# EAGLE design roduinoRF2 (EAGLE 6.2)
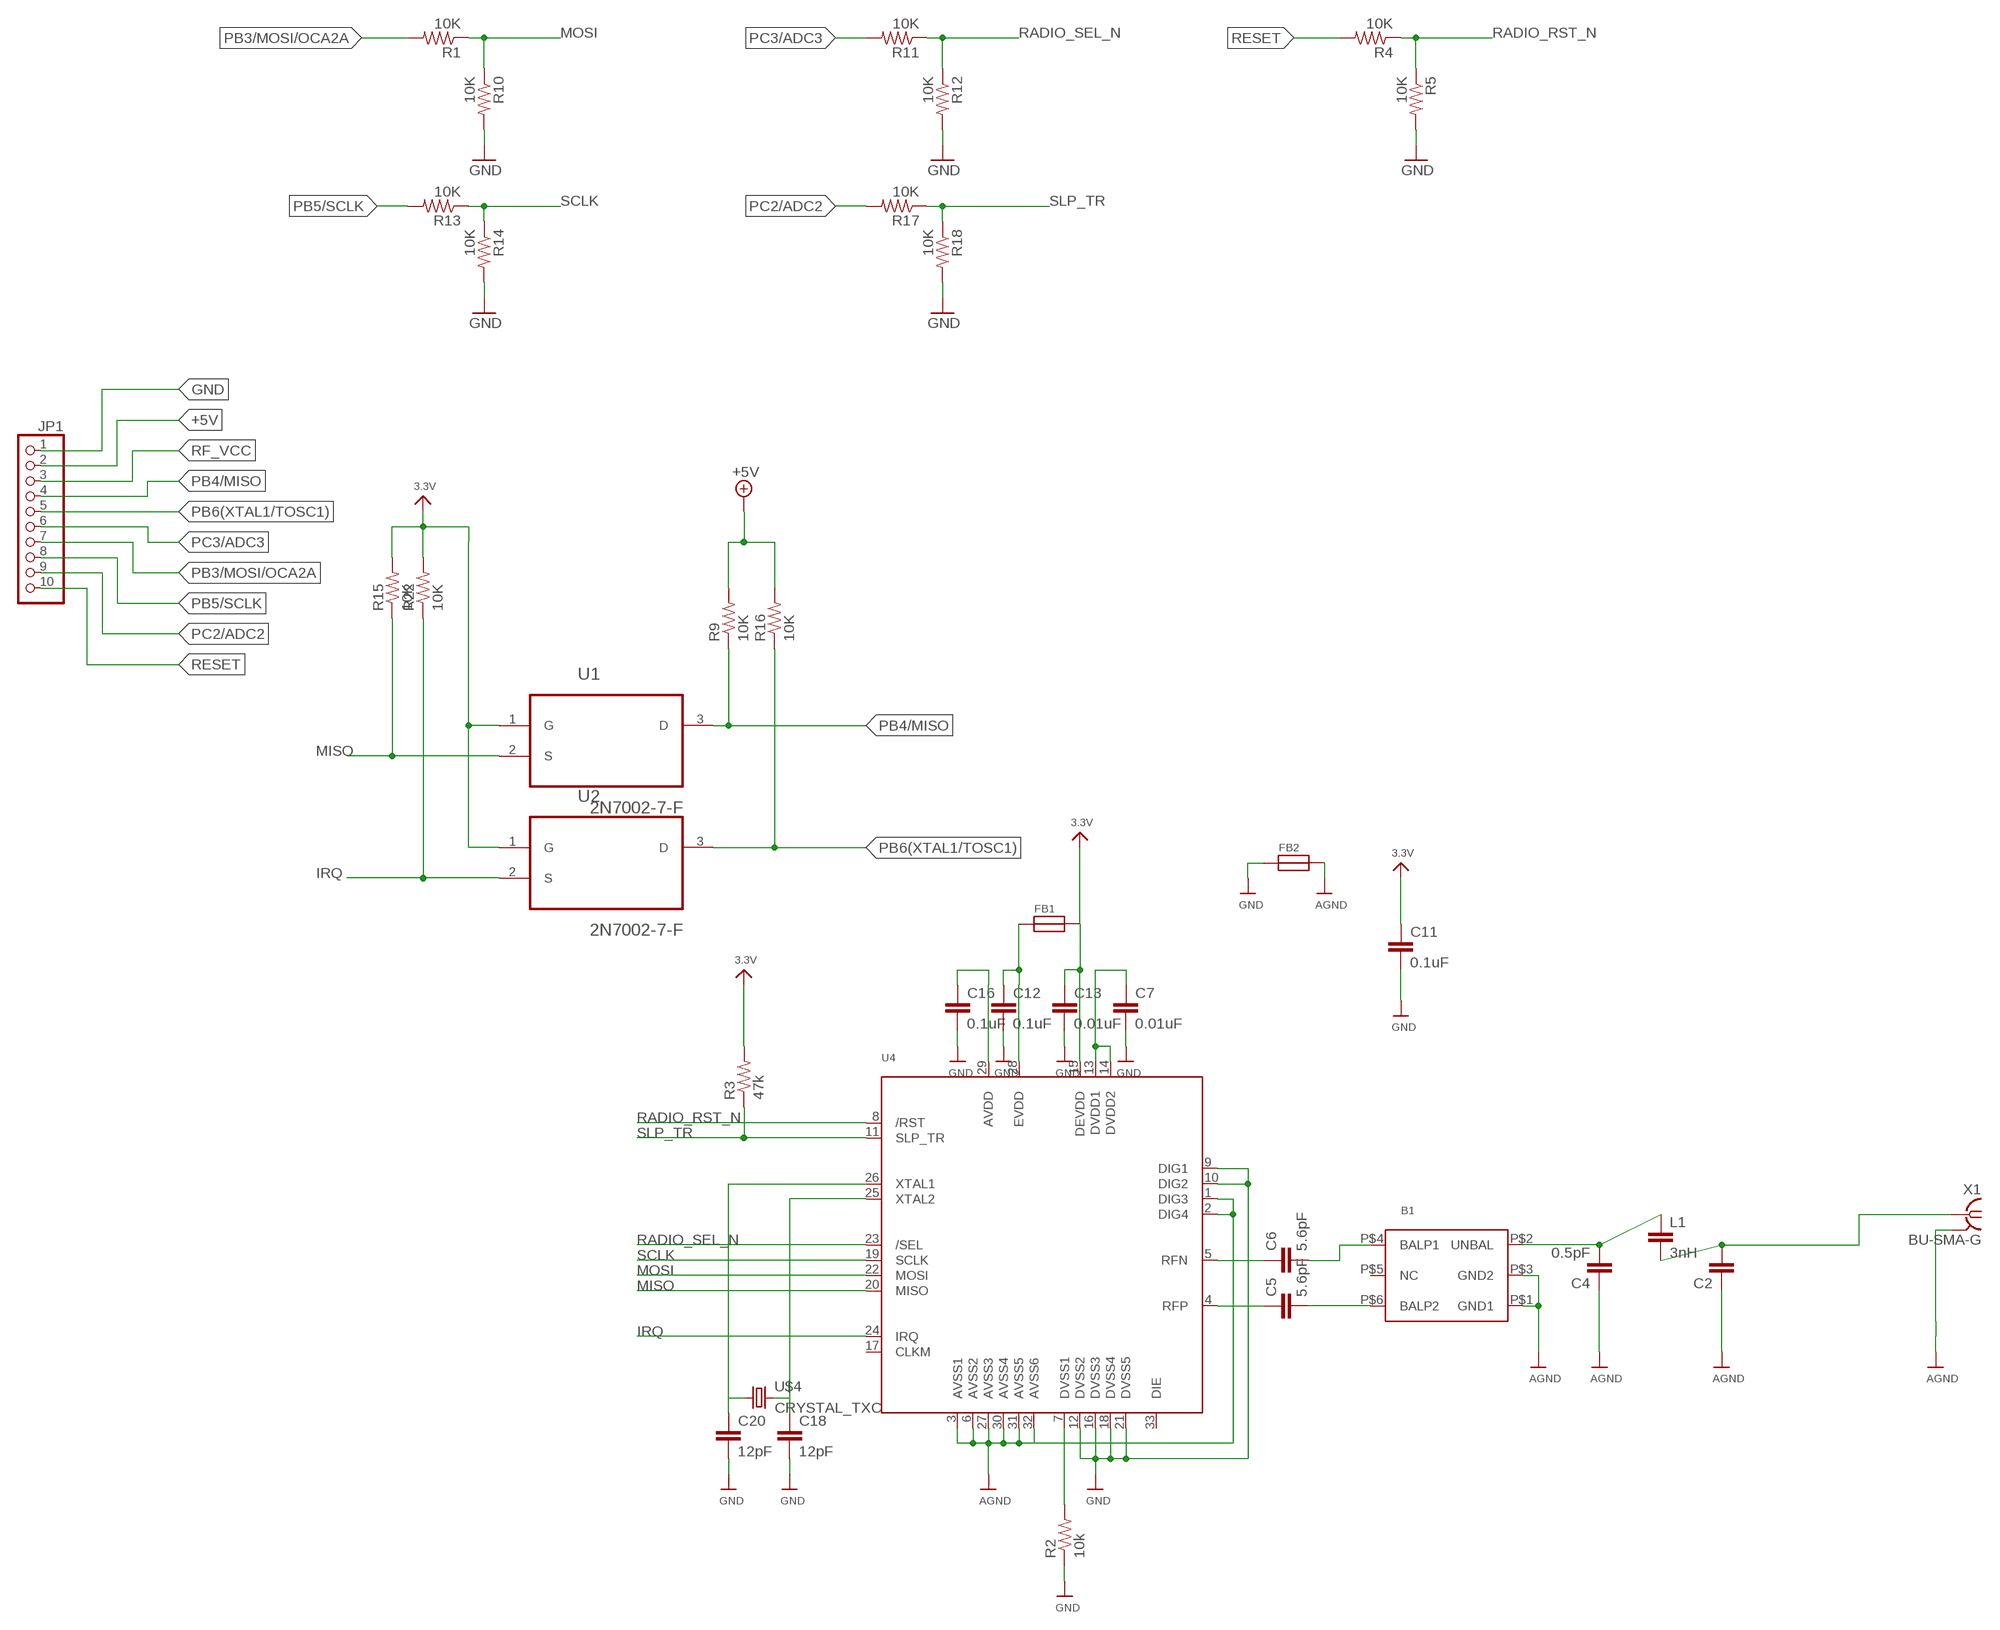
[diagram p0: schematic, sheet 1]

## Parts
B1  BALUN  [BALUN1206]
C2  CAP0805  [0805]
C4  0.5pF  CAP0805  [0805]
C5  5.6pF  CAP0805  [0805]
C6  5.6pF  CAP0805  [0805]
C7  0.01uF  CAP0805  [0805]
C11  0.1uF  CAP0805  [0805]
C12  0.1uF  CAP0805  [0805]
C13  0.01uF  CAP0805  [0805]
C16  0.1uF  CAP0805  [0805]
C18  12pF  CAP0805  [0805]
C20  12pF  CAP0805  [0805]
FB1  FERRITE  [0603]
FB2  FERRITE  [0603]
JP1  PINHD-1X10  [1X10]
L1  3nH  CAP0805  [0805]
R1  10K  RESISTOR0805-RES  [0805]
R2  10k  RESISTOR0805-RES  [0805]
R3  47k  RESISTOR0805-RES  [0805]
R4  10K  RESISTOR0805-RES  [0805]
R5  10K  RESISTOR0805-RES  [0805]
R9  10K  RESISTOR0805-RES  [0805]
R10  10K  RESISTOR0805-RES  [0805]
R11  10K  RESISTOR0805-RES  [0805]
R12  10K  RESISTOR0805-RES  [0805]
R13  10K  RESISTOR0805-RES  [0805]
R14  10K  RESISTOR0805-RES  [0805]
R15  10K  RESISTOR0805-RES  [0805]
R16  10K  RESISTOR0805-RES  [0805]
R17  10K  RESISTOR0805-RES  [0805]
R18  10K  RESISTOR0805-RES  [0805]
R22  10K  RESISTOR0805-RES  [0805]
U1  2N7002-7-F  [SOT103P240X110-3N]
U2  2N7002-7-F  [SOT103P240X110-3N]
U4  AT86RF212  [32QN2]
U$4  CRYSTAL_TXC  [CRYSTAL_TCX]
X1  BU-SMA-G  [BU-SMA-G]

## Nets
+5V: JP1.2 R9.2 R16.2
AGND: B1.P$1(GND1) B1.P$3(GND2) C2.1 C4.1 FB2.2 U4.1(DIG3) U4.2(DIG4) U4.3(AVSS1) U4.6(AVSS2) U4.27(AVSS3) U4.30(AVSS4) U4.31(AVSS5) U4.32(AVSS6) X1.5(GND)
GND: C7.2 C11.2 C12.2 C13.2 C16.2 C18.2 C20.2 FB2.1 JP1.1 R2.1 R5.2 R10.2 R12.2 R14.2 R18.2 U4.9(DIG1) U4.10(DIG2) U4.12(DVSS2) U4.16(DVSS3) U4.18(DVSS4) U4.21(DVSS5)
IRQ: R22.1 U2.2(S) U4.24(IRQ)
MISO: R15.1 U1.2(S) U4.20(MISO)
MOSI: R1.1 R10.1 U4.22(MOSI)
N$17: C6.1 U4.5(RFN)
N$20: C5.1 U4.4(RFP)
N$21: B1.P$4(BALP1) C6.2
N$22: B1.P$6(BALP2) C5.2
N$23: B1.P$2(UNBAL) C4.2 L1.1
N$24: C2.2 L1.2 X1.1
N$26: C20.1 U4.26(XTAL1) U$4.1
N$27: C18.1 U4.25(XTAL2) U$4.2
N$28: R2.2 U4.7(DVSS1)
N$29: C7.1 U4.13(DVDD1) U4.14(DVDD2)
N$30: C12.1 FB1.1 U4.28(EVDD)
N$31: C16.1 U4.29(AVDD)
PB3/MOSI/OCA2A: JP1.7 R1.2
PB4/MISO: JP1.4 R9.1 U1.3(D)
PB5/SCLK: JP1.8 R13.2
PB6(XTAL1/TOSC1): JP1.5 R16.1 U2.3(D)
PC2/ADC2: JP1.9 R17.2
PC3/ADC3: JP1.6 R11.2
RADIO_RST_N: R4.1 R5.1 U4.8(/RST)
RADIO_SEL_N: R11.1 R12.1 U4.23(/SEL)
RESET: JP1.10 R4.2
RF_VCC: C11.1 C13.1 FB1.2 JP1.3 R3.2 R15.2 R22.2 U1.1(G) U2.1(G) U4.15(DEVDD) ; supply symbol labelled 3.3V
SCLK: R13.1 R14.1 U4.19(SCLK)
SLP_TR: R3.1 R17.1 R18.1 U4.11(SLP_TR)
Unconnected: B1.P$5(NC) U4.17(CLKM) U4.33(DIE)

## Power pins joined to a net without a drawn wire
AGND: X1.2(AGND) X1.3(AGND) X1.4(AGND)

## Library data of the parts
B1 = microbuilder:BALUN: BALUN - Baluns for RF 1206 800-1000MHz Balun (1206) - Digikey: 712-1023-1-ND
C2 C4-C7 C11-C13 C16 C18 C20 L1 = SparkFun:CAP: Capacitor Standard 0603 ceramic capacitor, and 0.1" leaded capacitor.
FB1 FB2 = microbuilder:FERRITE: Ferrite Bead 0603 MMZ1608B121C - 120 Ohm, 600mA Ferrite Chip - Digikey: 445-2164-1-ND BK1608HW121-T - 120 Ohm, 600mA Ferrite Chip - Digikey: 587-1876-2-ND
JP1 = pinhead:PINHD-1X10: PIN HEADER
R1-R5 R9-R18 R22 = SparkFun:RESISTOR: Resistor Basic schematic elements and footprints for 0603, 1206, and PTH resistors.
U1 U2 = 2N7002:2N7002-7-F: N-CHANNEL ENHANCEMENT MODE FIELD EFFECT TRANSISTOR; MPN: 2N7002-7-F; OC_FARNELL: 1713823; OC_NEWARK: 25R5679; PACKAGE: SOT-23-3; SUPPLIER: DIODES INC.
U4 = microbuilder:AT86RF212: AT86RF212 - Low-Power SPI-based 700/800/900 MHz Transceiver Digikey: AT86RF212-ZU-ND
U$4 = crystal_txc:CRYSTAL_TXC: TXC - 7A-16.000MAAJ-T - XTAL, 16.000MHZ, 18PF, SMD, 5.0X3.2
X1 = con-coax:BU-SMA-G: FEMALE SMA CONNECTOR Radiall distributor RS 193-9117; OC_FARNELL: unknown; OC_NEWARK: unknown

## Net classes
1 power: width 0.61 mm, drill 0.61 mm, clearance 0.254 mm
2 gnd: width 0.305 mm, drill 0.559 mm, clearance 0.254 mm
3 usbvcc: width 0.508 mm, drill 0.61 mm, clearance 0.254 mm

## Board
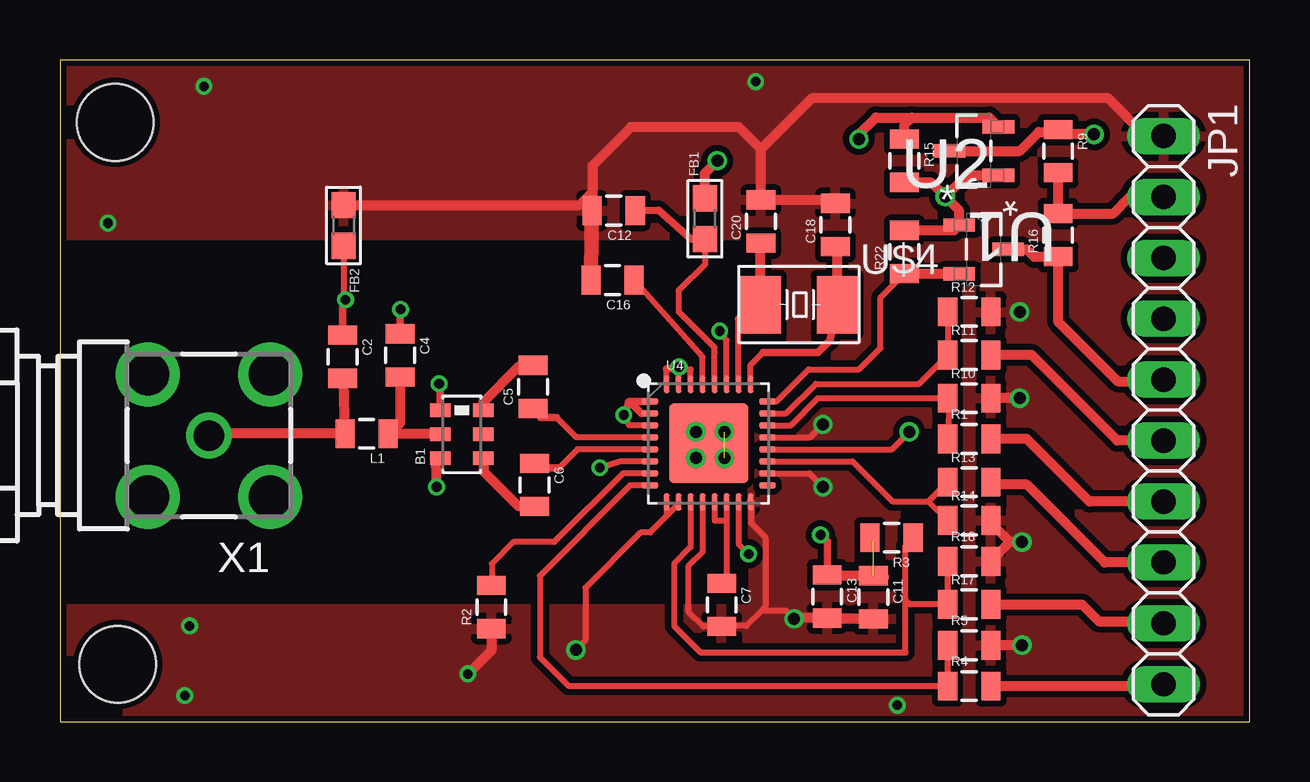
[diagram p1: board, top side]
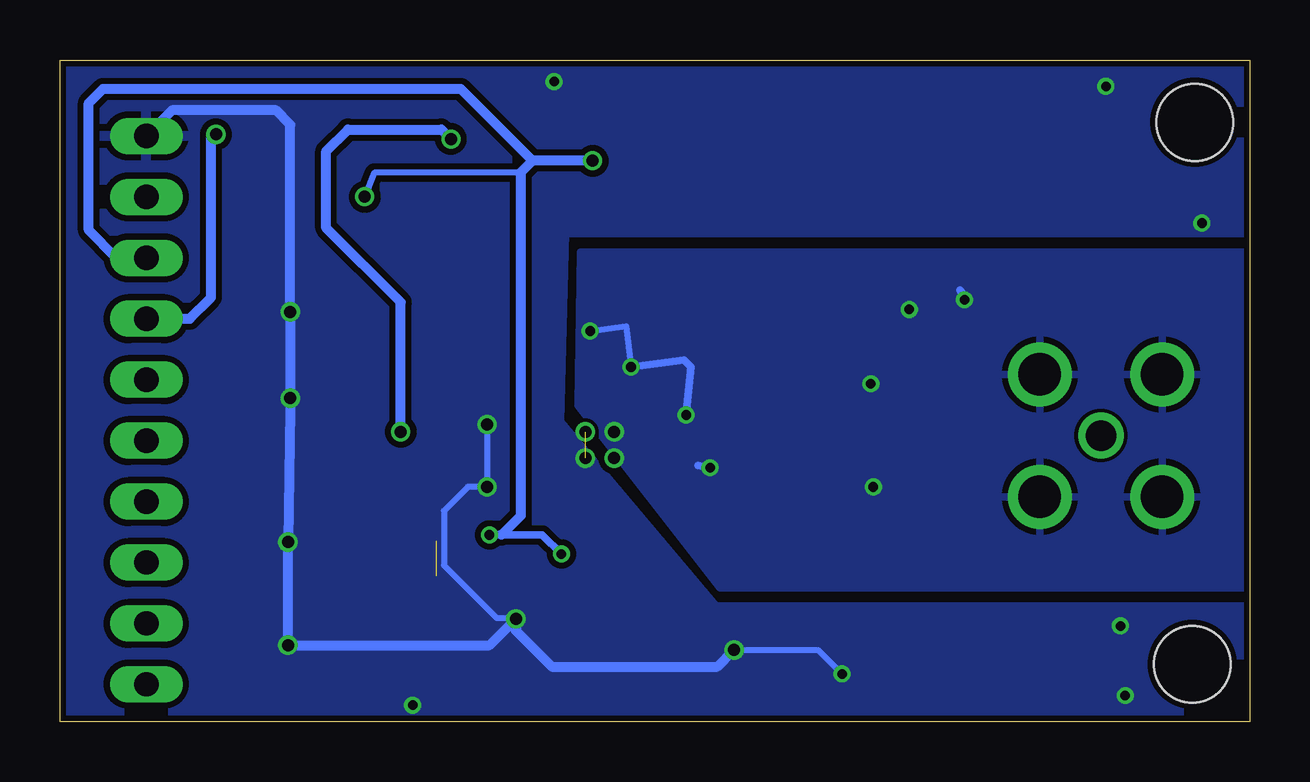
[diagram p2: board, bottom side, seen from below]

Size 49.6 x 27.6 mm. Coordinates in mm from the lower left corner, seen from the top.
Outline: 0,0 49.6,0 49.6,27.6 0,27.6 0,0
Copper layers (1*16): Top 0.035mm / dielectric 1.5mm / Bottom 0.035mm
Design rules: minimum track width 6mil, minimum drill 12mil, track to track 6mil, track to pad 6mil, pad to pad 6mil, via to via 6mil, smd to smd 0mil, copper to edge 10mil, drill to drill 10mil, minimum pad ring 10mil, minimum via ring 6mil, stop-mask expansion 2mil, vias tented up to drill 100mil, thermal gap 10mil
Holes 3.2 mm at 2.3,25 2.4,2.4

### Footprints (pad centres in the part's own frame; a part is rotated, then mirrored left to right if it is on the bottom)
BALUN1206 = smd 0.55 x 0.85: P$1 1,0.9; P$2 0,0.9; P$3 -1,0.9; P$4 -1,-0.9; P$5 0,-0.9; P$6 1,-0.9
0805 = smd 0.8 x 1.2: 1 -0.9,0; 2 0.9,0
0603 = smd 1.1 x 1: 1 -0.85,0; 2 0.85,0
1X10 = drill 1.016 long: 1 -11.43,0; 2 -8.89,0; 3 -6.35,0; 4 -3.81,0; 5 -1.27,0; 6 1.27,0; 7 3.81,0; 8 6.35,0; 9 8.89,0; 10 11.43,0
SOT103P240X110-3N = smd 1.321 x 0.559: 1 -1.016,1.016; 2 -1.016,-1.016; 3 1.016,0
32QN2 = smd 0.7 x 0.25: 1 -2.45,1.75; 2 -2.45,1.25; 3 -2.45,0.75; 4 -2.45,0.25; 5 -2.45,-0.25; 6 -2.45,-0.75; 7 -2.45,-1.25; 8 -2.45,-1.75; 17 2.45,-1.75; 18 2.45,-1.25; 19 2.45,-0.75; 20 2.45,-0.25; 21 2.45,0.25; 22 2.45,0.75; 23 2.45,1.25; 24 2.45,1.75 | smd 0.25 x 0.7: 9 -1.75,-2.45; 10 -1.25,-2.45; 11 -0.75,-2.45; 12 -0.25,-2.45; 13 0.25,-2.45; 14 0.75,-2.45; 15 1.25,-2.45; 16 1.75,-2.45; 25 1.75,2.45; 26 1.25,2.45; 27 0.75,2.45; 28 0.25,2.45; 29 -0.25,2.45; 30 -0.75,2.45; 31 -1.25,2.45; 32 -1.75,2.45 | smd 3.3 x 3.3: 33 0,0
CRYSTAL_TCX = smd 1.7 x 2.4: 1 -1.6,0; 2 1.6,0
BU-SMA-G = drill 1.27: 1 0,0 | drill 1.778: 2 -2.55,2.55; 3 2.55,2.55; 4 2.55,-2.55; 5 -2.55,-2.55

### Placement (x,y rotation side)
B1  16.75,12 90 top
C2  11.78,15.23 270 top
C4  14.18,15.28 270 top
C5  19.72,13.97 90 top
C6  19.78,9.88 270 top
C7  27.58,4.88 270 top
C11  33.9,5.2 270 top
C12  23.08,21.32 180 top
C13  31.98,5.23 270 top
C16  23.03,18.42 180 top
C18  32.32,20.72 90 top
C20  29.22,20.87 90 top
FB1  26.88,20.98 90 top
FB2  11.82,20.7 270 top
JP1  46,13 270 top
L1  12.78,12.02 180 top
R1  37.9,11.8 0 top
R2  17.98,4.79 90 top
R3  34.66,7.68 180 top
R4  37.9,1.5 0 top
R5  37.9,3.2 0 top
R9  41.6,23.8 270 top
R10  37.9,13.5 0 top
R11  37.9,15.3 0 top
R12  37.9,17.1 0 top
R13  37.9,10 0 top
R14  37.9,8.4 0 top
R15  35.2,23.4 270 top
R16  41.6,20.3 90 top
R17  37.9,4.9 0 top
R18  37.9,6.7 0 top
R22  35.2,19.6 90 top
U1  38.1,23.8 180 top
U2  38.5,19.7 0 top
U4  27.04,11.62 0 top
U$4  30.8,17.4 0 top
X1  6.21,11.94 180 top

### Tracks (layer width: path | path; a pad name or v marks a point on that pad's centre or on a via)
+5V
  Top 0.406: R9.2 R16.2 43.9,21.2 44.6,21.9 JP1.2
AGND  (via drill 0.4, 0.5)
  Top 0.254: U4.32 25.29,14.71 25.3,14.7 25.8,14.7 | U4.2 24.23,12.87 | U4.3 23.73,12.37 23.7,12.4 v23.5,12.8 23.7,13.34 | U4.6 23.37,10.87 v22.5,10.6 | U4.27 27.79,15.91 v27.5,16.3 | U4.30 26.29,14.69 26.3,14.7 25.8,14.7 | U4.31 25.79,14.69 25.8,14.7 | FB2.2 11.82,17.68 v11.9,17.6
  Top 0.305: 25.29,14.71 v25.8,14.8 | U4.1 23.73,13.37 | 23.73,13.37 v23.5,12.8 | B1.P$1 15.85,14.25 v15.8,14.1 | C4.1 14.18,16.98 v14.2,17.2 | C2.1 11.78,17.28 v11.9,17.6 | 24.23,12.87 23.73,13.37 | 23.7,13.34 23.73,13.37
  Top 0.406: B1.P$3 15.65,10.85 v15.7,9.8
  Bottom 0.254: v27.5,16.3 26,16.5 v25.8,14.8
  Bottom 0.305: v25.8,14.8 23.6,15.1 23.3,14.8 v23.5,12.8 | v11.9,17.6 12.1,18 11.9,17.8 | v22.5,10.6 23,10.7
  other vias: 26.5,12.1 26.5,11
  pour Bottom: 0,5.6 22.1,5.6 28,13.2 27.9,19.6 0,19.6
GND  (via drill 0.4, 0.5)  (1 unrouted)
  Top 0.254: U4.12 26.8,7.1 26.2,6.5 26.2,4.6 26.82,3.98 C7.2 27.6,4 28.6,4 29.25,4.65 | U4.9 25.29,8.59 | 25.29,8.59 24.6,7.9 24.2,7.9 21.9,5.6 21.9,3.4 v21.5,3 | U4.10 25.79,9.09 25.29,8.59 | U4.16 28.8,8.3 29.4,7.7 29.4,4.8 29.25,4.65 | 29.25,4.65 30.25,4.65 v30.6,4.3 | U4.18 31.23,10.37 v31.8,9.8 | U4.21 31.27,11.87 v31.8,12.4
  Top 0.305: U4.16
  Top 0.406: R2.1 17.98,2.98 v17,2 | C11.2 32.01,4.3 C13.2 30.63,4.33 v30.6,4.3 | 38.9,13.4 R10.2 v40,13.5 | v40.1,7.5 39.6,7.5 | 39.6,7.5 R18.2 | R14.2 38.8,8.3 39.6,7.5 | v40.1,3.2 R5.2 | C18.2 32.17,21.77 C20.2 29.22,23.88 | 29.22,23.88 28.3,24.8 23.8,24.8 22.2,23.2 22.2,22.1 | 22.2,22.1 22.2,21.34 C12.2 | JP1.1 45.27,24.43 43.7,26 31.34,26 29.22,23.88 | FB2.1 21.65,21.55 22.2,22.1
  Top 0.61: 33.77,4.38 C11.2 | C12.2 22.13,18.87 C16.2
  Bottom 0.254: v21.5,3 18,3 v17,2 | v30.6,4.3 30.63,4.33 31.4,4.33 33.6,6.53 33.6,8.8 32.6,9.8 v31.8,9.8 v31.8,12.4
  Bottom 0.406: v21.5,3 22.2,2.3 29.1,2.3 30.6,3.8 v30.6,4.3 31.7,3.2 v40.1,3.2 v40.1,7.5 40,13 v40,13.5 v40,17.1 40,24.9 40.6,25.5 44.93,25.5 JP1.1
  other vias: 27.7,12.1 27.7,11 5.4,4 5.2,1.1 2,20.8 6,26.5 29,26.7 34.9,0.7
  pour Bottom (isolate 0.254): 0.7,0.2 51.7,0.4 51.1,28.3 -0.1,28.1 0.1,20.4 28.6,20.4 28.8,12.5 22.3,4.8 0,4.8 0,0
  pour Top (isolate 0.254): 0,0 51.6,0 50.6,28 -0.2,28.4 0,20.3 28.7,20.3 28.9,4.7 0,4.7
IRQ
  Top 0.254: U4.24 29.87,13.37 31.2,14.7 33.3,14.7 34.2,15.6 34.2,17.7 R22.1
  Top 0.406: R22.1 37.47,18.7 U2.2
MISO  (via drill 0.5)
  Top 0.254: U4.20 34.67,11.37 v35.4,12.1
  Top 0.406: v33.3,24.3 33.3,24.5 34,25.2 35.5,25.2 | 35.5,25.2 38.73,25.2 U1.2 | R15.1 35.2,24.9 35.5,25.2
  Bottom 0.406: v35.4,12.1 35.4,17.5 38.5,20.6 38.5,23.8 37.6,24.7 33.7,24.7 v33.3,24.3
MOSI
  Top 0.254: U4.22 30.47,12.37 31.6,13.5 R10.1 | R10.1 37.1,13.2 | 37.1,13.2 37,13.3 R10.1 | R1.1 37.1,13.2
N$17
  Top 0.254: U4.5 21.57,11.37 20.8,10.6
  Top 0.305: 20.8,10.6 20.01,10.6 C6.1
N$20
  Top 0.254: U4.4 21.53,11.87 20.7,12.7
  Top 0.305: 20.7,12.7 20.04,12.7 C5.1
N$21
  Top 0.406: B1.P$4 17.65,10.45 19.1,9 19.71,9 C6.2
N$22
  Top 0.406: B1.P$6 17.65,13.35 19.1,14.8 19.6,14.8 C5.2
N$23
  Top 0.406: C4.2 14.18,12.47 L1.1 13.75,12 B1.P$2
N$24
  Top 0.406: C2.2 11.83,14.23 L1.2 6.29,12.02 X1.1
N$26
  Top 0.254: U4.26 28.29,16.79
  Top 0.305: 28.29,16.79 U$4.1
  Top 0.406: U$4.1 29.2,19.95 C20.1
N$27
  Top 0.254: U4.25 28.79,14.89 29.3,15.4
  Top 0.305: 29.3,15.4 31.6,15.4 32.1,15.9 U$4.2
  Top 0.406: U$4.2 32.4,19.74 C18.1
N$28
  Top 0.254: U4.7 23.47,10.37 20.6,7.5 18.9,7.5 18,6.6 18,5.71 R2.2
N$29
  Top 0.254: U4.14 27.79,8.4 | U4.13 27.29,8.41 27.3,8.4 27.79,8.4 | 27.79,8.4 27.79,5.99 C7.1
N$30
  Top 0.254: U4.28 27.29,15.41 27.29,15.61 25.8,17.1 25.8,18 26.9,19.1 26.9,20.11 FB1.1
  Top 0.305: 26.9,20.11 FB1.1 26.3,20.13 24.94,21.33 C12.1
N$31
  Top 0.254: U4.29 26.79,15.21 C16.1
PB3/MOSI/OCA2A
  Top 0.406: JP1.7 42.91,9.19 40.3,11.8 R1.2
PB4/MISO  (via drill 0.5)
  Top 0.406: U1.3 40,23.8 40.8,24.6 41.5,24.6 R9.1 41.8,24.5 v43.1,24.5
  Bottom 0.406: JP1.4 44.19,16.81 43.3,17.7 43.3,24.3 v43.1,24.5
PB5/SCLK
  Top 0.406: JP1.8 43.55,6.65 40.3,9.9 38.9,9.9 R13.2
PB6(XTAL1/TOSC1)
  Top 0.406: U2.3 40.3,19.7 40.6,19.4 R16.1 41.6,16.7 44.1,14.2 45.93,14.2 JP1.5
PC2/ADC2
  Top 0.406: R17.2 42.6,4.9 43.3,4.2 45.91,4.2 JP1.9
PC3/ADC3
  Top 0.406: JP1.6 44.07,11.73 40.5,15.3 R11.2
RADIO_RST_N
  Top 0.254: U4.8 23.77,9.87 20,6.1 20,2.7 21.2,1.5 35.3,1.5 R4.1 R5.1
RADIO_SEL_N
  Top 0.254: R12.1 R11.1 35.8,14.1 31.5,14.1 30.27,12.87 U4.23
RESET
  Top 0.406: R4.2 45.93,1.5 JP1.10
RF_VCC  (via drill 0.4, 0.5)  (1 unrouted)
  Top 0.254: U4.15 28.29,7.41 v28.7,7
  Top 0.305: C13.1 31.98,7.52 v31.7,7.8
  Top 0.406: C13.1 32.01,6.1 C11.1 34.36,6.04 | FB1.2 26.88,22.88 v27.4,23.4 | 33.9,7.54 R3.2 | R22.2 37.27,20.5 U2.1 37.48,21.32 v36.9,21.9 | R15.2 36.3,22.5 v36.9,21.9 | U1.1 37.78,22.78 v36.9,21.9
  Top 0.61: 32.11,6.15 C13.1
  Bottom 0.254: 30.4,22.9 36.5,22.9 v36.9,21.9
  Bottom 0.305: v31.7,7.8 31.2,7.8 29.5,7.8 v28.7,7
  Bottom 0.406: 28.8,6.9 v28.7,7 | v27.4,23.4 29.9,23.4 | 29.9,23.4 30.4,22.9 30.4,8.6 31.2,7.8 | JP1.3 47.25,19.35 48.4,20.5 48.4,25.8 47.8,26.4 32.9,26.4 29.9,23.4
SCLK
  Top 0.254: U4.19 33.03,10.87 34.7,9.2 36.2,9.2 | 36.2,9.2 R13.1 | R14.1 36.2,9.2
SLP_TR
  Top 0.254: U4.11 26.29,7.38 26.29,7.29 25.6,6.6 25.6,4 26.7,2.9 35.24,2.9 35.24,5.1 | R18.1 R17.1 35.44,4.9 35.24,5.1 | 35.24,5.1 35.24,7.36 R3.1